# EAGLE design oven-controller-v1 (EAGLE 6.4)
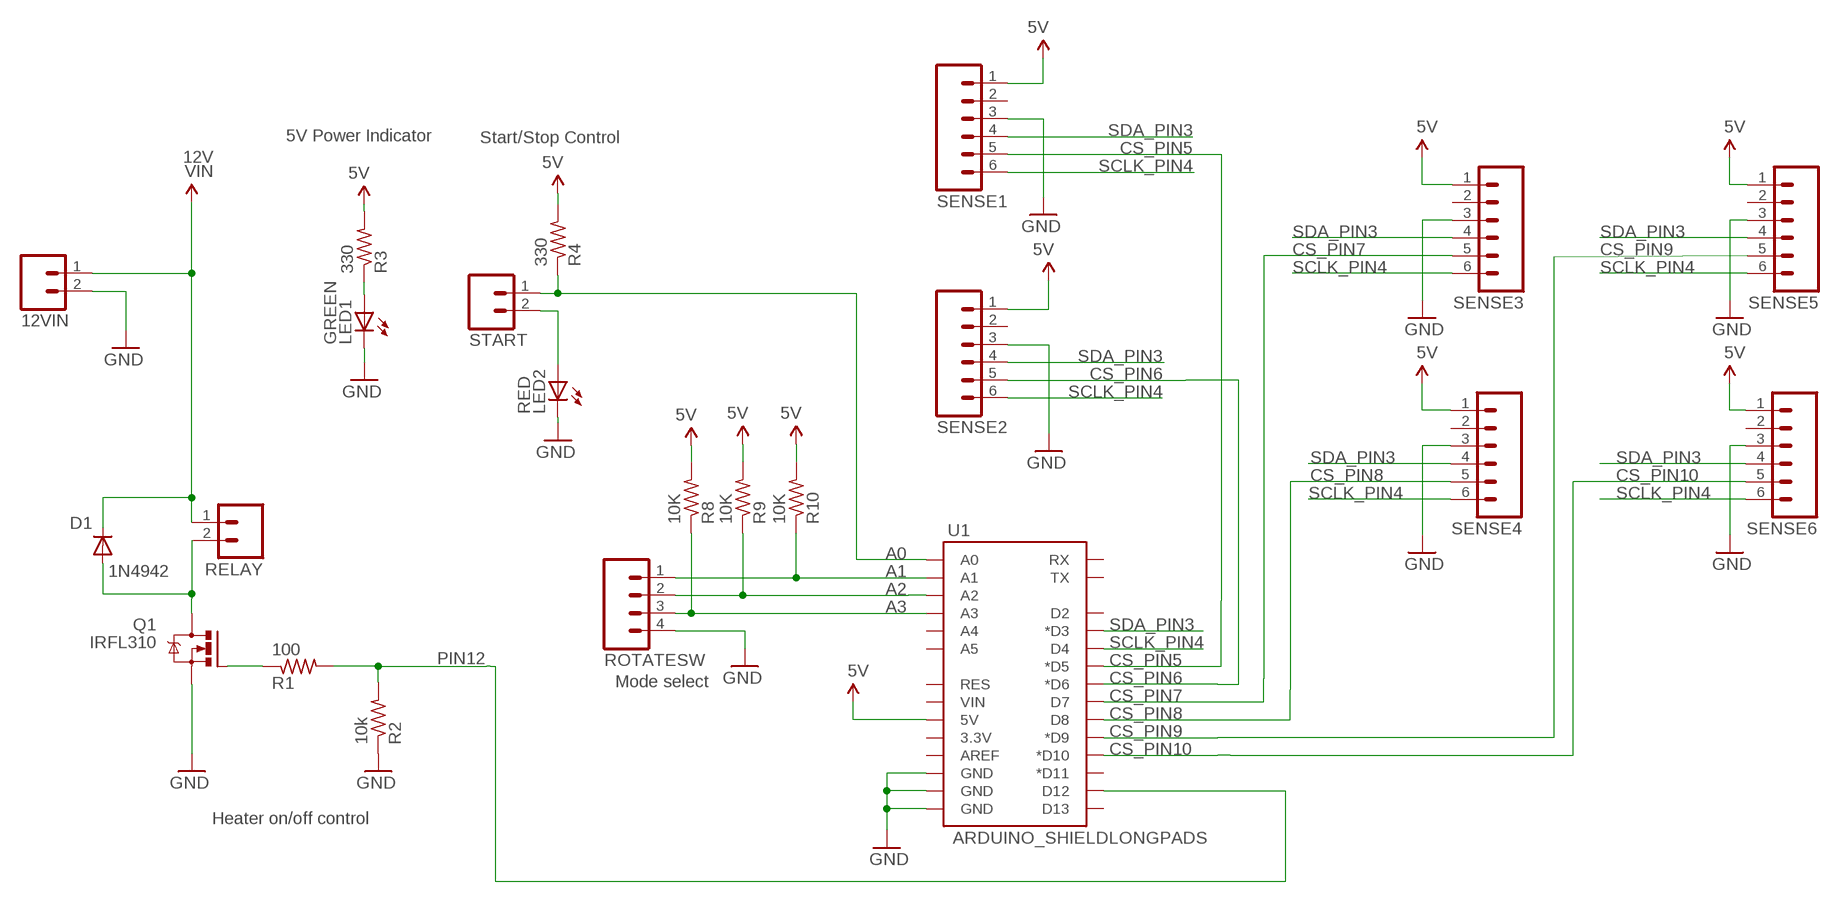
[diagram p0: schematic, sheet 1]

## Parts
12VIN  M023.5MM_LOCK  [SCREWTERMINAL-3.5MM-2_LOCK]
D1  1N4942  [DO41-10]
LED1  GREEN  LED5MM  [LED5MM]
LED2  RED  LED5MM  [LED5MM]
Q1  IRFL310  IRF520  [TO220BV]
R1  100  R-US_V234/12  [V234/12]
R2  10k  R-US_V234/12  [V234/12]
R3  330  R-US_0207/10  [0207/10]
R4  330  R-US_0207/10  [0207/10]
R8  10K  R-US_0207/10  [0207/10]
R9  10K  R-US_0207/10  [0207/10]
R10  10K  R-US_0207/10  [0207/10]
RELAY  M023.5MM_LOCK  [SCREWTERMINAL-3.5MM-2_LOCK]
ROTATESW  M04LOCK_LONGPADS  [1X04_LOCK_LONGPADS]
SENSE1  M06LOCK_LONGPADS  [1X06_LOCK_LONGPADS]
SENSE2  M06LOCK_LONGPADS  [1X06_LOCK_LONGPADS]
SENSE3  M06LOCK_LONGPADS  [1X06_LOCK_LONGPADS]
SENSE4  M06LOCK_LONGPADS  [1X06_LOCK_LONGPADS]
SENSE5  M06LOCK_LONGPADS  [1X06_LOCK_LONGPADS]
SENSE6  M06LOCK_LONGPADS  [1X06_LOCK_LONGPADS]
START  M023.5MM_LOCK  [SCREWTERMINAL-3.5MM-2_LOCK]
U1  ARDUINO_SHIELDLONGPADS  [DUEMILANOVE_SHIELD_LONGPADS]

## Nets
5V: R3.2 R4.2 R8.2 R9.2 R10.2 SENSE1.1 SENSE2.1 SENSE3.1 SENSE4.1 SENSE5.1 SENSE6.1 U1.5V
A0: R4.1 START.1 U1.A0
A1: R10.1 ROTATESW.1 U1.A1
A2: R9.1 ROTATESW.2 U1.A2
A3: R8.1 ROTATESW.3 U1.A3
CS_PIN5: SENSE1.5 U1.D5(*D5)
CS_PIN6: SENSE2.5 U1.D6(*D6)
CS_PIN7: SENSE3.5 U1.D7
CS_PIN8: SENSE4.5 U1.D8
CS_PIN9: SENSE5.5 U1.D9(*D9)
CS_PIN10: SENSE6.5 U1.D10(*D10)
GND: 12VIN.2 LED1.K(C) LED2.K(C) Q1.S R2.1 ROTATESW.4 SENSE1.3 SENSE2.3 SENSE3.3 SENSE4.3 SENSE5.3 SENSE6.3 U1.GND@0(GND) U1.GND@1(GND) U1.GND@2(GND)
N$2: Q1.G R1.1
N$3: D1.A Q1.D RELAY.2
N$10: LED2.A START.2
N$11: LED1.A R3.1
PIN12: R1.2 R2.2 U1.D12
SCLK_PIN4: SENSE1.6 SENSE2.6 SENSE3.6 SENSE4.6 SENSE5.6 SENSE6.6 U1.D4
SDA_PIN3: SENSE1.4 SENSE2.4 SENSE3.4 SENSE4.4 SENSE5.4 SENSE6.4 U1.D3(*D3)
VIN: 12VIN.1 D1.C RELAY.1
Unconnected: SENSE1.2 SENSE2.2 SENSE3.2 SENSE4.2 SENSE5.2 SENSE6.2 U1.3.3V U1.A4 U1.A5 U1.AREF U1.D2 U1.D11(*D11) U1.D13 U1.RES U1.RX U1.TX U1.VIN

## Notes on the sheet
- 5V Power Indicator | Start/Stop Control
- 12V
- Mode select
- Heater on/off control

## Library data of the parts
12VIN RELAY START = SparkFun-Connectors:M02: Header 2 Standard 2-pin 0.1" header. Use with straight break away headers (SKU : PRT-00116), right angle break away headers (PRT-00553), swiss pins (PRT-00743), machine pins (PRT-00117), and female headers (PRT-00115). Molex polarized connector foot print use with SKU : PRT-08233 with associated crimp pins and housings.
D1 = diode:1N4942: DIODE 1.0 A, 200 V, 150 ns
LED1 LED2 = led:LED: LED OSRAM: - CHIPLED LG R971, LG N971, LY N971, LG Q971, LY Q971, LO R971, LY R971 LH N974, LH R974 LS Q976, LO Q976, LY Q976 LO Q996 - Hyper CHIPLED LW Q18S LB Q993, LB Q99A, LB R99A - SideLED LS A670, LO A670, LY A670, LG A670, LP A670 LB A673, LV A673, LT A673, LW A673 LH A674 LY A675 LS A676, LA A676, LO A676, LY A676, LW A676 LS A679, LY A679, LG A679 - Hyper Micro SIDELED® LS Y876, LA Y876, LO Y876, LY Y876 LT Y87S - SmartLED LW L88C, LW L88S LB L89C, LB L89S, LG L890 LS L89K, LO L89K, LY L89K LS L896, LA L896, LO L896, LY L896 - TOPLED LS T670, LO T670, LY T670, LG T670, LP T670 LSG T670, LSP T670, LSY T670, LOP T670, LYG T670 LG T671, LOG T671, LSG T671 LB T673, LV T673, LT T673, LW T673 LH T674 LS T676, LA T676, LO T676, LY T676, LB T676, LH T676, LSB T676, LW T676 LB T67C, LV T67C, LT T67C, LS T67K, LO T67K, LY T67K, LW E67C LS E67B, LA E67B, LO E67B, LY E67B, LB E67C, LV E67C, LT E67C LW T67C LS T679, LY T679, LG T679 LS T770, LO T770, LY T770, LG T770, LP T770 LB T773, LV T773, LT T773, LW T773 LH T774 LS E675, LA E675, LY E675, LS T675 LS T776, LA T776, LO T776, LY T776, LB T776 LHGB T686 LT T68C, LB T68C - Hyper Mini TOPLED® LB M676 - Mini TOPLED Santana® LG M470 LS M47K, LO M47K, LY M47K Source: http://www.osram.convergy.de LUXEON: - LUMILED® LXK2-PW12-R00, LXK2-PW12-S00, LXK2-PW14-U00, LXK2-PW14-V00 LXK2-PM12-R00, LXK2-PM12-S00, LXK2-PM14-U00 LXK2-PE12-Q00, LXK2-PE12-R00, LXK2-PE12-S00, LXK2-PE14-T00, LXK2-PE14-U00 LXK2-PB12-K00, LXK2-PB12-L00, LXK2-PB12-M00, LXK2-PB14-N00, LXK2-PB14-P00, LXK2-PB14-Q00 LXK2-PR12-L00, LXK2-PR12-M00, LXK2-PR14-Q00, LXK2-PR14-R00 LXK2-PD12-Q00, LXK2-PD12-R00, LXK2-PD12-S00 LXK2-PH12-R00, LXK2-PH12-S00 LXK2-PL12-P00, LXK2-PL12-Q00, LXK2-PL12-R00 Source: www.luxeon.com KINGBRIGHT: KA-3528ASYC Source: www.kingbright.com
Q1 = transistor-power:IRF520: HEXFET Power MOSFET
R1-R4 R8-R10 = resistor:R-US_: RESISTOR, American symbol
ROTATESW = SparkFun-Connectors:M04: Header 4 Standard 4-pin 0.1" header. Use with straight break away headers (SKU : PRT-00116), right angle break away headers (PRT-00553), swiss pins (PRT-00743), machine pins (PRT-00117), and female headers (PRT-00115). Molex polarized connector foot print use with SKU : PRT-08231 with associated crimp pins and housings. 1MM SMD Version SKU: PRT-10208
SENSE1-SENSE6 = SparkFun-Connectors:M06: Header 6 Standard 6-pin 0.1" header. Use with straight break away headers (SKU : PRT-00116), right angle break away headers (PRT-00553), swiss pins (PRT-00743), machine pins (PRT-00117), and female headers (PRT-00115). Molex polarized connector foot print use with SKU : PRT-08094 with associated crimp pins and housings. NOTES ON THE VARIANTS LOCK and LOCK_LONGPADS... This footprint was designed to help hold the alignment of a through-hole component (i.e. 6-pin header) while soldering it into place. You may notice that each hole has been shifted either up or down by 0.005 of an inch from it's more standard position (which is a perfectly straight line). This slight alteration caused the pins (the squares in the middle) to touch the edges of the holes. Because they are alternating, it causes a "brace" to hold the component in place. 0.005 has proven to be the perfect amount of "off-center" position when using our standard breakaway headers. Although looks a little odd when you look at the bare footprint, once you have a header in there, the alteration is very hard to notice. Also, if you push a header all the way into place, it is covered up entirely on the bottom side. This idea of altering the position of holes to aid alignment will be further integrated into the Sparkfun Library for other footprints. It can help hold any component with 3 or more connection pins.
U1 = SparkFun-Boards:ARDUINO_SHIELD: Arduino shield footprint

## Board
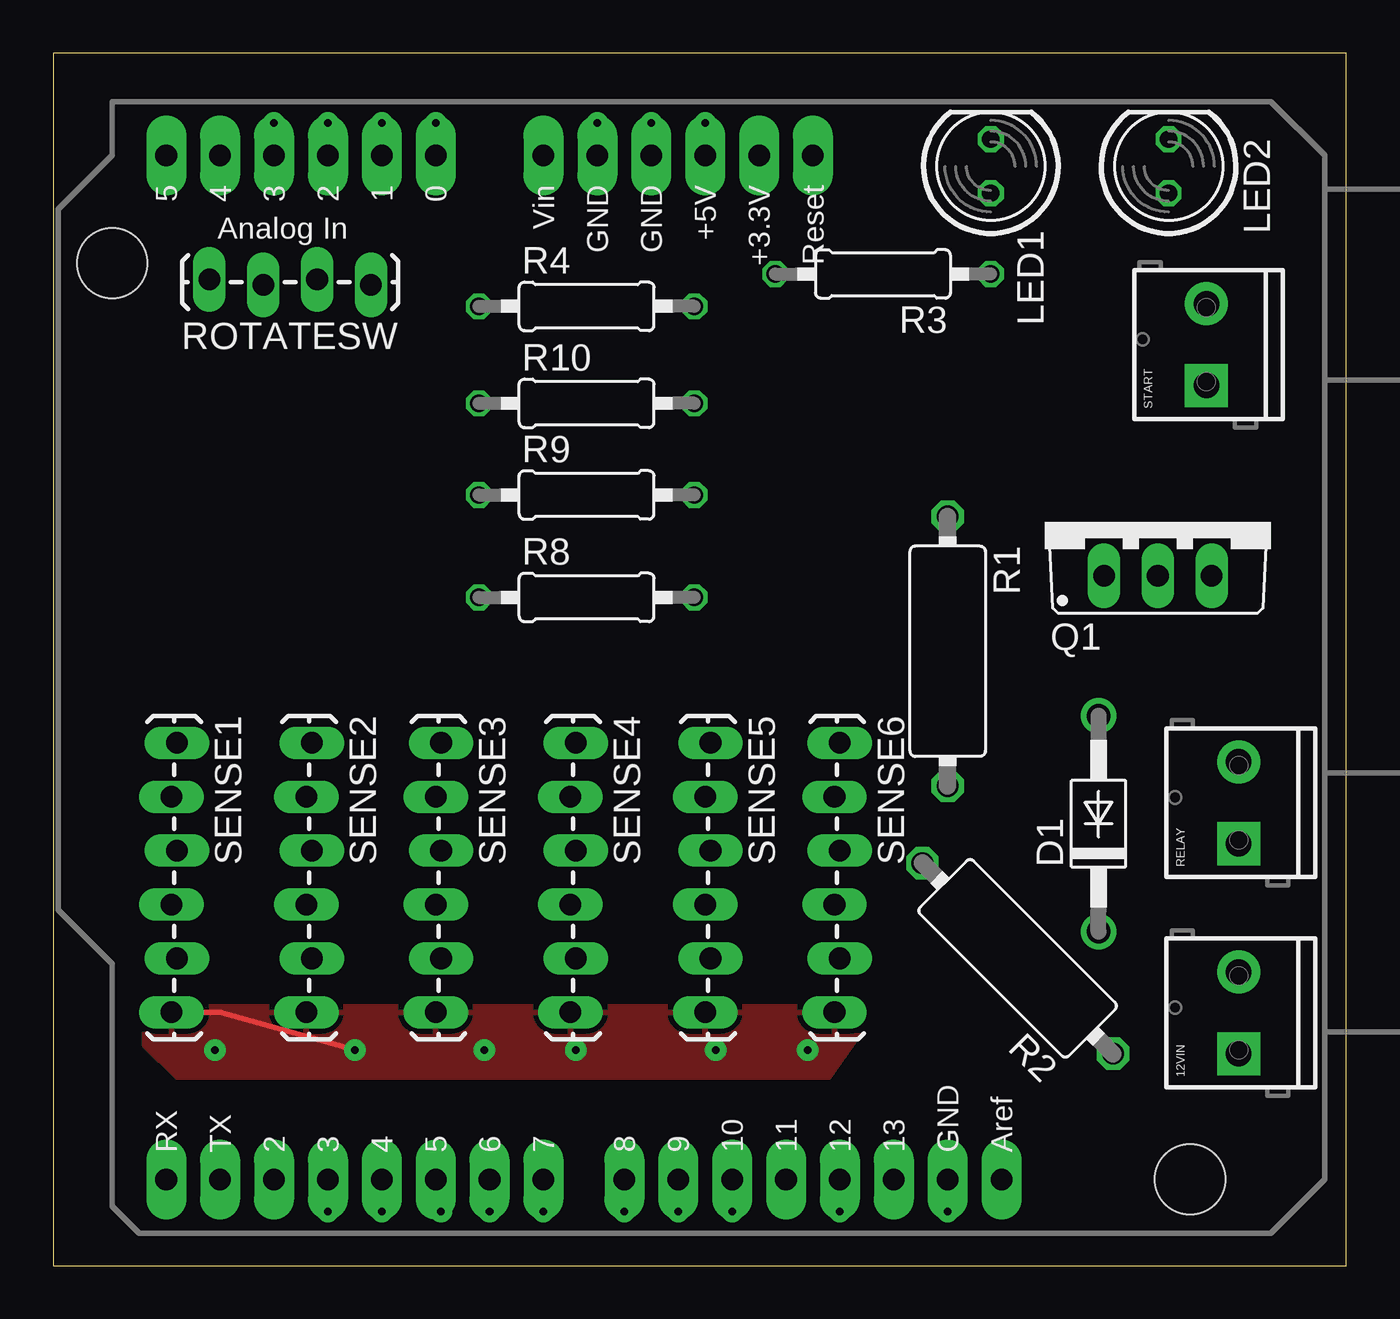
[diagram p1: board, top side]
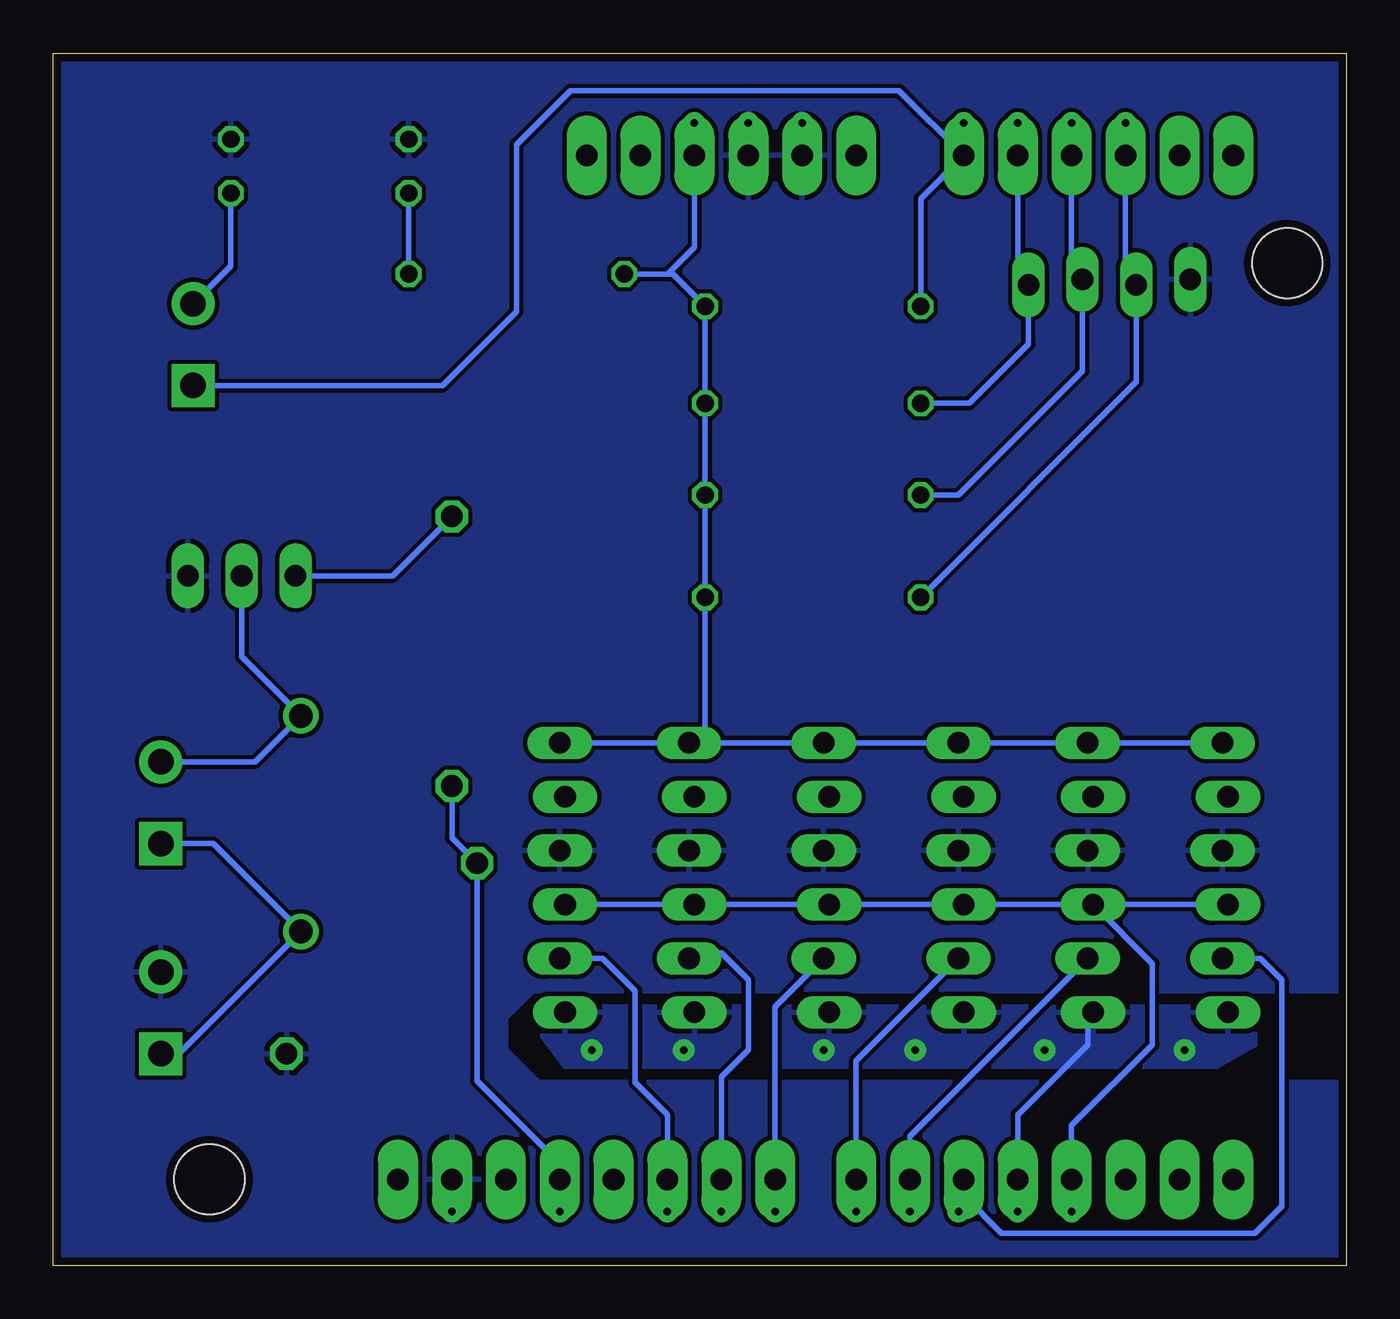
[diagram p2: board, bottom side, seen from below]

Size 60.96 x 57.15 mm. Coordinates in mm from the lower left corner, seen from the top.
Outline: 0,0 60.96,0 60.96,57.15 0,57.15 0,0
Copper layers (1*16): Top 0.0178mm / dielectric 59mil / Bottom 0.0178mm
Design rules "epl-lpkf": minimum track width 8mil, minimum drill 0.35mm, track to track 8mil, track to pad 8mil, pad to pad 8mil, via to via 8mil, smd to smd 8mil, copper to edge 15mil, drill to drill 15mil, minimum pad ring 8mil, minimum via ring 8mil, stop-mask expansion 3mil, vias tented up to drill 0mil, thermal gap 10mil

### Footprints (pad centres in the part's own frame; a part is rotated, then mirrored left to right if it is on the bottom)
SCREWTERMINAL-3.5MM-2_LOCK = drill 1.2 pad 2.032 square: 1 -0.178,0 | drill 1.2 pad 2.032: 2 3.678,0
DO41-10 = drill 1.118: A 5.08,0; C -5.08,0
LED5MM = drill 0.813 octagon: A -1.27,0; K 1.27,0
TO220BV = drill 1.016 long: D 0,-2.54; G -2.54,-2.54; S 2.54,-2.54
V234/12 = drill 1.016 octagon: 1 -6.35,0; 2 6.35,0
0207/10 = drill 0.813 octagon: 1 -5.08,0; 2 5.08,0
1X04_LOCK_LONGPADS = drill 1.016 long: 1 0,0; 2 2.54,-0.254; 3 5.08,0; 4 7.62,-0.254
1X06_LOCK_LONGPADS = drill 1.016 long: 1 0,0; 2 2.54,-0.254; 3 5.08,0; 4 7.62,-0.254; 5 10.16,0; 6 12.7,-0.254
DUEMILANOVE_SHIELD_LONGPADS = drill 1.016 pad 1.88 long: 3.3V 50.8,26.67; 5V 50.8,29.21; A0 50.8,41.91; A1 50.8,44.45; A2 50.8,46.99; A3 50.8,49.53; A4 50.8,52.07; A5 50.8,54.61; AREF 2.54,15.24; D2 2.54,49.53; D3 2.54,46.99; D4 2.54,44.45; D5 2.54,41.91; D6 2.54,39.37; D7 2.54,36.83; D8 2.54,33.02; D9 2.54,30.48; D10 2.54,27.94; D11 2.54,25.4; D12 2.54,22.86; D13 2.54,20.32; GND@0 50.8,31.75; GND@1 50.8,34.29; GND@2 2.54,17.78; RES 50.8,24.13; RX 2.54,54.61; TX 2.54,52.07; VIN 50.8,36.83 | hole 3.302: 45.72,57.15; 2.54,6.35

### Placement (x,y rotation side)
12VIN  55.88,10.16 90 top
D1  49.28,20.83 90 top
LED1  44.2,51.82 90 top
LED2  52.58,51.82 90 top
Q1  52.07,35.05 0 top
R1  42.16,28.96 270 top
R2  45.47,14.48 135 top
R3  39.12,46.74 180 top
R4  25.15,45.21 0 top
R8  25.15,31.5 0 top
R9  25.15,36.32 0 top
R10  25.15,40.64 0 top
RELAY  55.88,20.07 90 top
ROTATESW  14.99,46.23 180 top
SENSE1  5.84,24.64 270 top
SENSE2  12.19,24.64 270 top
SENSE3  18.29,24.64 270 top
SENSE4  24.64,24.64 270 top
SENSE5  30.99,24.64 270 top
SENSE6  37.08,24.64 270 top
START  54.36,41.66 90 top
U1  59.94,1.52 90 top

### Tracks (layer width: path | path; a pad name or v marks a point on that pad's centre or on a via)
5V  (via drill 0.36 pad 1.02)
  Bottom 0.254: SENSE1.1 SENSE2.1 SENSE3.1 SENSE4.1 SENSE5.1 | SENSE5.1 SENSE6.1 | R3.2 32,46.74 | 32,46.74 31.75,46.74 R4.2 R10.2 R9.2 R8.2 30.23,25.4 SENSE5.1 | 32,46.74 30.73,48.01 U1.5V v30.73,53.85
A0  (via drill 0.36 pad 1.02)
  Bottom 0.254: START.1 42.6,41.48 39.12,44.96 39.12,52.83 36.58,55.37 21.08,55.37 U1.A0 | R4.1 20.07,50.29 U1.A0 | v18.03,53.85 U1.A0
A1  (via drill 0.36 pad 1.02)
  Bottom 0.254: R10.1 17.78,40.64 14.99,43.43 ROTATESW.1 15.49,46.74 U1.A1 v15.49,53.85
A2  (via drill 0.36 pad 1.02)
  Bottom 0.254: R9.1 18.29,36.32 12.45,42.16 ROTATESW.2 12.95,46.99 U1.A2 v12.95,53.85
A3  (via drill 0.36 pad 1.02)
  Bottom 0.254: R8.1 9.91,41.66 ROTATESW.3 10.41,46.74 U1.A3 v10.41,53.85
CS_PIN5  (via drill 0.36 pad 1.02)
  Bottom 0.254: U1.D5 18.03,3.3 | 18.03,3.3 16.26,1.52 4.32,1.52 4.06,1.78 | 4.06,1.78 3.56,2.29 | SENSE1.5 4.06,14.48 3.05,13.46 3.05,2.79 4.06,1.78 | v18.29,2.54 18.03,2.54 18.03,3.3
CS_PIN6  (via drill 0.36 pad 1.02)
  Bottom 0.254: SENSE2.5 20.57,6.1 U1.D6 v20.57,2.54
CS_PIN7  (via drill 0.36 pad 1.02)
  Bottom 0.254: SENSE3.5 23.11,9.65 U1.D7 v23.11,2.54
CS_PIN8  (via drill 0.36 pad 1.02)
  Bottom 0.254: SENSE4.5 26.92,12.19 U1.D8 v26.92,2.54
CS_PIN9  (via drill 0.36 pad 1.02)
  Bottom 0.254: SENSE5.5 30.73,14.73 29.46,14.73 28.19,13.46 28.19,10.16 29.46,8.89 U1.D9 v29.46,2.54
CS_PIN10  (via drill 0.36 pad 1.02)
  Bottom 0.254: SENSE6.5 35.05,14.48 33.53,12.95 33.53,8.64 32,7.11 U1.D10 v32,2.54
GND  (via drill 0.36 pad 1.02)
  other vias: 25.65,53.85 28.19,53.85 42.16,2.54
  pour Bottom: 61.21,57.66 -0.76,57.66 -1.02,13.72 -0.25,12.95 38.35,12.95 39.62,11.68 39.62,10.16 38.1,8.64 0.51,8.64 -1.02,7.11 -1.02,0 60.96,0
N$2
  Bottom 0.254: Q1.G 44.96,32.51 R1.1
N$3
  Bottom 0.254: RELAY.2 51.44,23.74 D1.A 52.07,28.7 Q1.D
N$10
  Bottom 0.254: LED2.A 52.58,47.11 START.2
N$11
  Bottom 0.254: LED1.A R3.1
PIN12  (via drill 0.36 pad 1.02)
  Bottom 0.254: R1.2 42.16,20.16 R2.2 40.98,8.72 40.01,7.75 | 40.01,7.75 37.08,4.83 U1.D12 v37.08,2.54 | 40.01,7.75 40.39,8.13
SCLK_PIN4  (via drill 0.36 pad 1.02)
  Top 0.254: SENSE5.6 30.99,11.94 | SENSE1.6 7.87,11.94 v14.22,10.16
  Bottom 0.254: SENSE2.6 12.19,11.68 12.19,10.41 15.49,7.11 U1.D4 v15.49,2.54
  other vias: 7.62,10.16 20.32,10.16 24.64,10.16 31.24,10.16 35.56,10.16
  pour Top: 4.32,11.94 4.32,10.41 5.84,8.89 36.58,8.89 38.35,11.43 37.59,12.19 4.57,12.19
  pour Bottom: 4.32,11.94 4.32,10.41 6.1,9.4 36.83,9.4 38.35,11.43 37.59,12.19 4.57,12.19
SDA_PIN3  (via drill 0.36 pad 1.02)
  Bottom 0.254: SENSE2.4 9.14,14.22 9.14,10.41 12.95,6.6 U1.D3 v12.95,2.54 | SENSE1.4 SENSE2.4 | SENSE2.4 SENSE3.4 SENSE4.4 SENSE5.4 SENSE6.4
VIN
  Bottom 0.254: RELAY.1 53.42,19.89 D1.C 55.04,9.98 12VIN.1